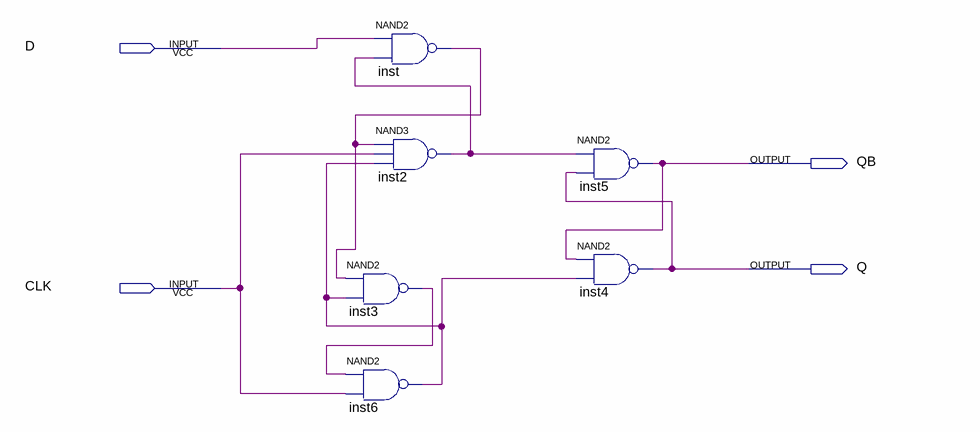
[diagram p0: schematic sheet]
// Quartus schematic FFD.bdf as structural Verilog: 6 symbols, 4 pins
module FFD (
  input  D,
  input  CLK,
  output QB,
  output Q
);

  wire inst2_out, inst3_out, inst6_out, inst_out;

  nand inst (inst_out, D, inst2_out);
  nand inst2 (inst2_out, inst_out, CLK, inst6_out);
  nand inst3 (inst3_out, inst_out, inst6_out);
  nand inst6 (inst6_out, inst3_out, CLK);
  nand inst5 (QB, inst2_out, Q);
  nand inst4 (Q, QB, inst6_out);
endmodule
